# EAGLE design untitled (EAGLE 7.2.0)
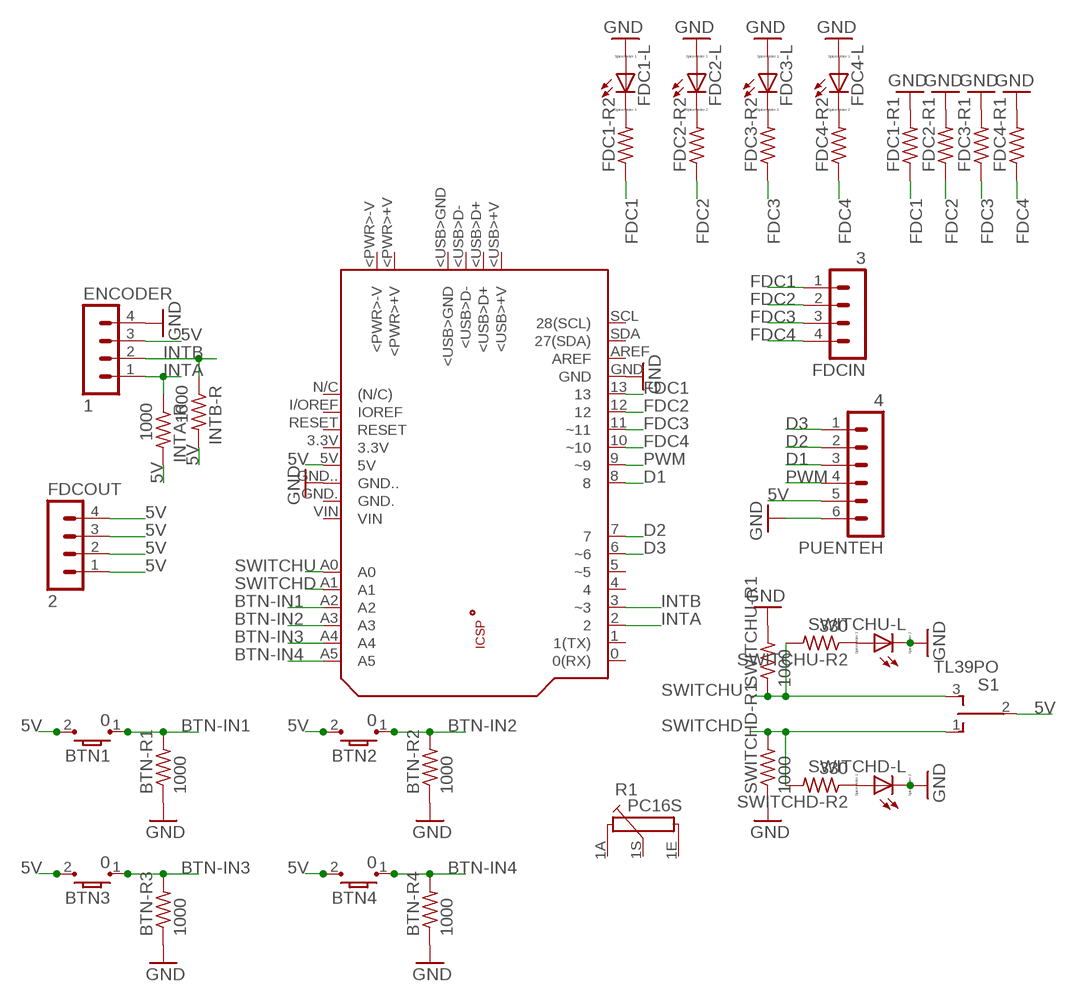
[diagram p0: schematic, sheet 1]

## Parts
BTN1  0  TL3302-J  [TL3303_J]
BTN2  0  TL3302-J  [TL3303_J]
BTN3  0  TL3302-J  [TL3303_J]
BTN4  0  TL3302-J  [TL3303_J]
BTN-R1  1000  R-US_0204/7  [0204/7]
BTN-R2  1000  R-US_0204/7  [0204/7]
BTN-R3  1000  R-US_0204/7  [0204/7]
BTN-R4  1000  R-US_0204/7  [0204/7]
ENCODER  1  MA04-1  [MA04-1]
FDC1-L  LED_ELD260  [LED_LD260]
FDC1-R1  R-US_0204/7  [0204/7]
FDC1-R2  R-US_0204/7  [0204/7]
FDC2-L  LED_ELD260  [LED_LD260]
FDC2-R1  R-US_0204/7  [0204/7]
FDC2-R2  R-US_0204/7  [0204/7]
FDC3-L  LED_ELD260  [LED_LD260]
FDC3-R1  R-US_0204/7  [0204/7]
FDC3-R2  R-US_0204/7  [0204/7]
FDC4-L  LED_ELD260  [LED_LD260]
FDC4-R1  R-US_0204/7  [0204/7]
FDC4-R2  R-US_0204/7  [0204/7]
FDCIN  3  MA04-1  [MA04-1]
FDCOUT  2  MA04-1  [MA04-1]
INTA-R  1000  R-US_0204/7  [0204/7]
INTB-R  1000  R-US_0204/7  [0204/7]
PCB1  ARDUINO_UNO  [ARDUINO_UNO]
PUENTEH  4  MA06-1  [MA06-1]
R1  PC16S  [PC16S]
S1  TL39PO  [TL3XPO]
SWITCHD-L  LED_ELD260  [LED_LD260]
SWITCHD-R1  1000  R-US_0204/7  [0204/7]
SWITCHD-R2  330  R-US_0204/7  [0204/7]
SWITCHU-L  LED_ELD260  [LED_LD260]
SWITCHU-R1  1000  R-US_0204/7  [0204/7]
SWITCHU-R2  330  R-US_0204/7  [0204/7]

## Nets
5V: BTN1.2 BTN2.2 BTN3.2 BTN4.2 ENCODER.3 FDCOUT.1 FDCOUT.2 FDCOUT.3 FDCOUT.4 INTA-R.2 INTB-R.2 PCB1.5V PUENTEH.5 S1.2(P)
BTN-IN1: BTN1.1 BTN-R1.2 PCB1.A2
BTN-IN2: BTN2.1 BTN-R2.2 PCB1.A3
BTN-IN3: BTN3.1 BTN-R3.2 PCB1.A4
BTN-IN4: BTN4.1 BTN-R4.2 PCB1.A5
D1: PCB1.8 PUENTEH.3
D2: PCB1.7 PUENTEH.2
D3: PCB1.6(~6) PUENTEH.1
FDC1: FDC1-R1.1 FDC1-R2.1 FDCIN.1 PCB1.13
FDC2: FDC2-R1.1 FDC2-R2.1 FDCIN.2 PCB1.12
FDC3: FDC3-R1.1 FDC3-R2.1 FDCIN.3 PCB1.11(~11)
FDC4: FDC4-R1.1 FDC4-R2.1 FDCIN.4 PCB1.10(~10)
GND: BTN-R1.1 BTN-R2.1 BTN-R3.1 BTN-R4.1 ENCODER.4 FDC1-L.A FDC1-R1.2 FDC2-L.A FDC2-R1.2 FDC3-L.A FDC3-R1.2 FDC4-L.A FDC4-R1.2 PCB1.GND PCB1.GND.. PUENTEH.6 SWITCHD-L.K(C) SWITCHD-R1.1 SWITCHU-L.K(C) SWITCHU-R1.2
INTA: ENCODER.1 INTA-R.1 PCB1.2
INTB: ENCODER.2 INTB-R.1 PCB1.3(~3)
N$1: FDC1-L.K(C) FDC1-R2.2
N$2: FDC2-L.K(C) FDC2-R2.2
N$3: SWITCHU-L.A SWITCHU-R2.1
N$4: SWITCHD-L.A SWITCHD-R2.1
N$6: FDC3-L.K(C) FDC3-R2.2
N$7: FDC4-L.K(C) FDC4-R2.2
PWM: PCB1.9(~9) PUENTEH.4
SWITCHD: PCB1.A1 S1.1(O) SWITCHD-R1.2 SWITCHD-R2.2
SWITCHU: PCB1.A0 S1.3(S) SWITCHU-R1.1 SWITCHU-R2.2
Unconnected: PCB1.0(0(RX)) PCB1.1(1(TX)) PCB1.3.3V PCB1.4 PCB1.5(~5) PCB1.+5V PCB1.<PWR>+V PCB1.<PWR>-V PCB1.<USB>+V PCB1.<USB>D+ PCB1.<USB>D- PCB1.<USB>GND PCB1.AREF PCB1.GND. PCB1.GND_ PCB1.I/OREF(IOREF) PCB1.MISO PCB1.MOSI PCB1.N/C((N/C)) PCB1.RESET PCB1.RESET. PCB1.SCK PCB1.SCL(28(SCL)) PCB1.SDA(27(SDA)) PCB1.VIN R1.1A R1.1E R1.1S

## Library data of the parts
BTN1-BTN4 = eswitch-tact:TL3302: E-Switch TL3302 Series Tactile Switch Surface mount button commonly used for reset or general input. 3.5 x 6mm packaged design. -G: Gull wing termination. Parts TL-3302-x-xxxx-x-G -J: J-Lead termination. Parts TL-3302-x-xxxx-x-J Source: http://www.e-switch.com/Portals/0/Series_Pdf/TL3302.pdf Supplier: DigiKey: http://be.digikey.com/scripts/dksearch/dksus.dll?vendor=0&keywords=TL3302
BTN-R1-BTN-R4 FDC1-R1 FDC1-R2 FDC2-R1 FDC2-R2 FDC3-R1 FDC3-R2 FDC4-R1 FDC4-R2 INTA-R INTB-R SWITCHD-R1 SWITCHD-R2 SWITCHU-R1 SWITCHU-R2 = resistor:R-US_: RESISTOR, American symbol
ENCODER FDCIN FDCOUT = con-lstb:MA04-1: PIN HEADER; OC_FARNELL: unknown; OC_NEWARK: unknown
FDC1-L FDC2-L FDC3-L FDC4-L SWITCHD-L SWITCHU-L = eagle-ltspice:LED_E: LED Source: http://www.osram.convergy.de Source: www.luxeon.com Source: www.kingbright.com; SPICEMODEL: NONE; SPICEPREFIX: D; SPICETYPE: diode
PCB1 = E14_Arduino_revB:ARDUINO_UNO: Device for representing an Arduino Uno board with a footprint in an EAGLE design. Created by Dave Young for Element14. More EAGLE documentation at: http://www.element14.com/community/community/knode/cadsoft_eagle
PUENTEH = con-lstb:MA06-1: PIN HEADER; OC_FARNELL: unknown; OC_NEWARK: unknown
R1 = piher:PC16S: POTENTIOMETER single carbon potentiometer, 16 mm, S3ROH; OC_FARNELL: 4452940; OC_NEWARK: unknown
S1 = switch:TL39PO: TINY SWITCH ON OFF ON Source: http://www2.produktinfo.conrad.com/datenblaetter/700000-724999/705152-da-01-de-Subminiaturschalter_TL_36YO.pdf

## Board
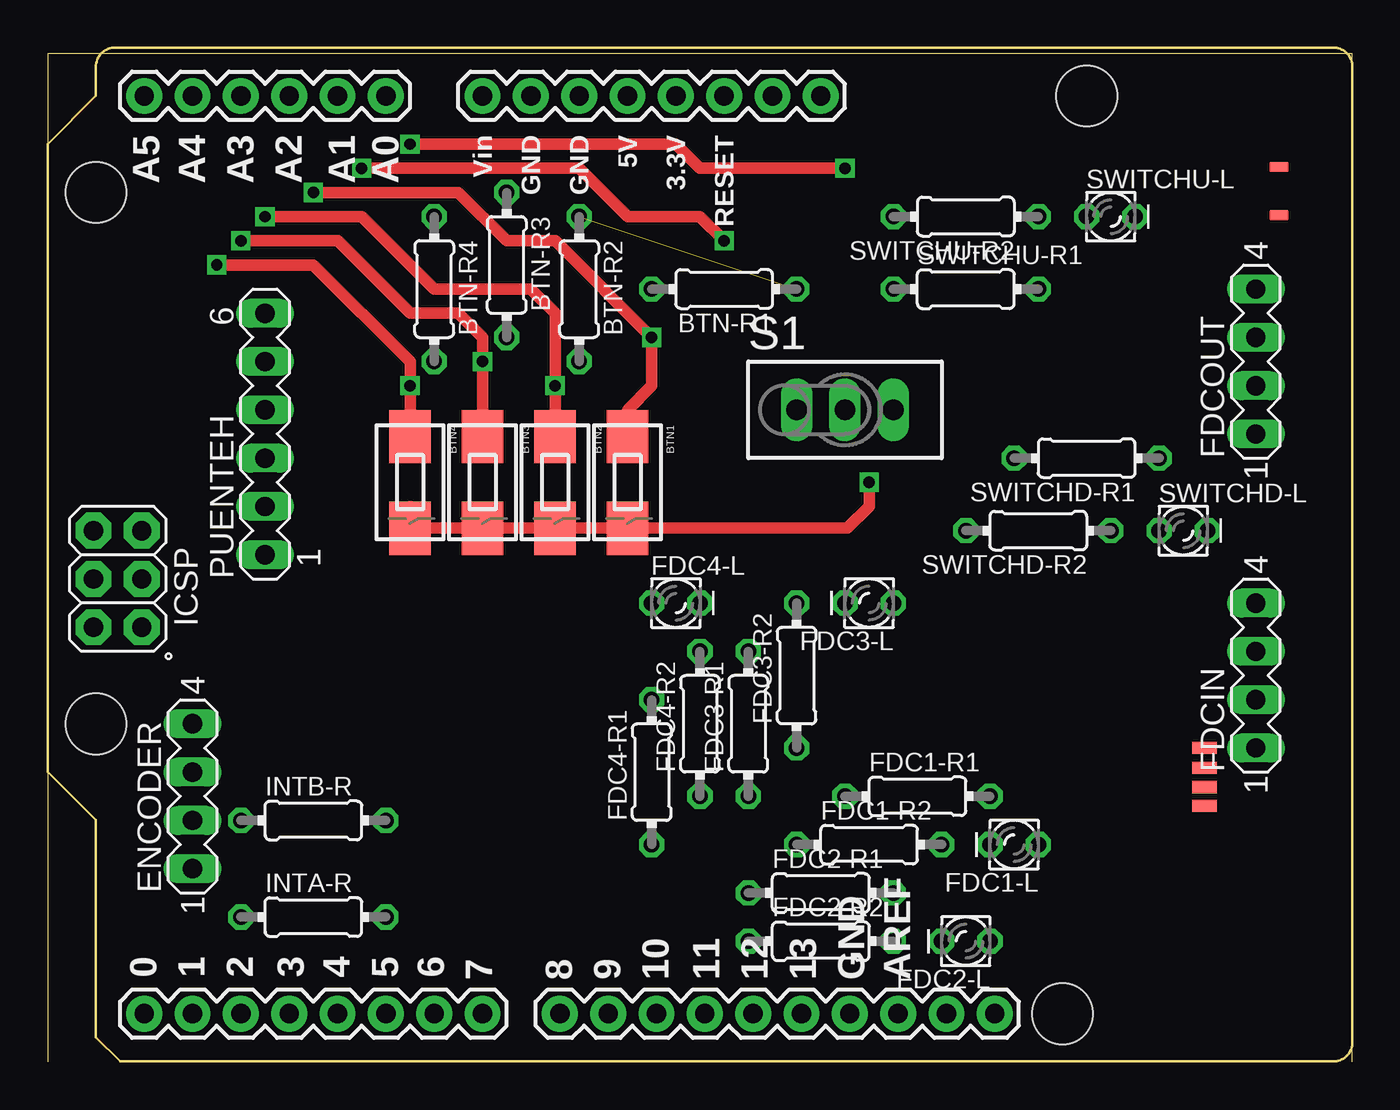
[diagram p1: board, top side]
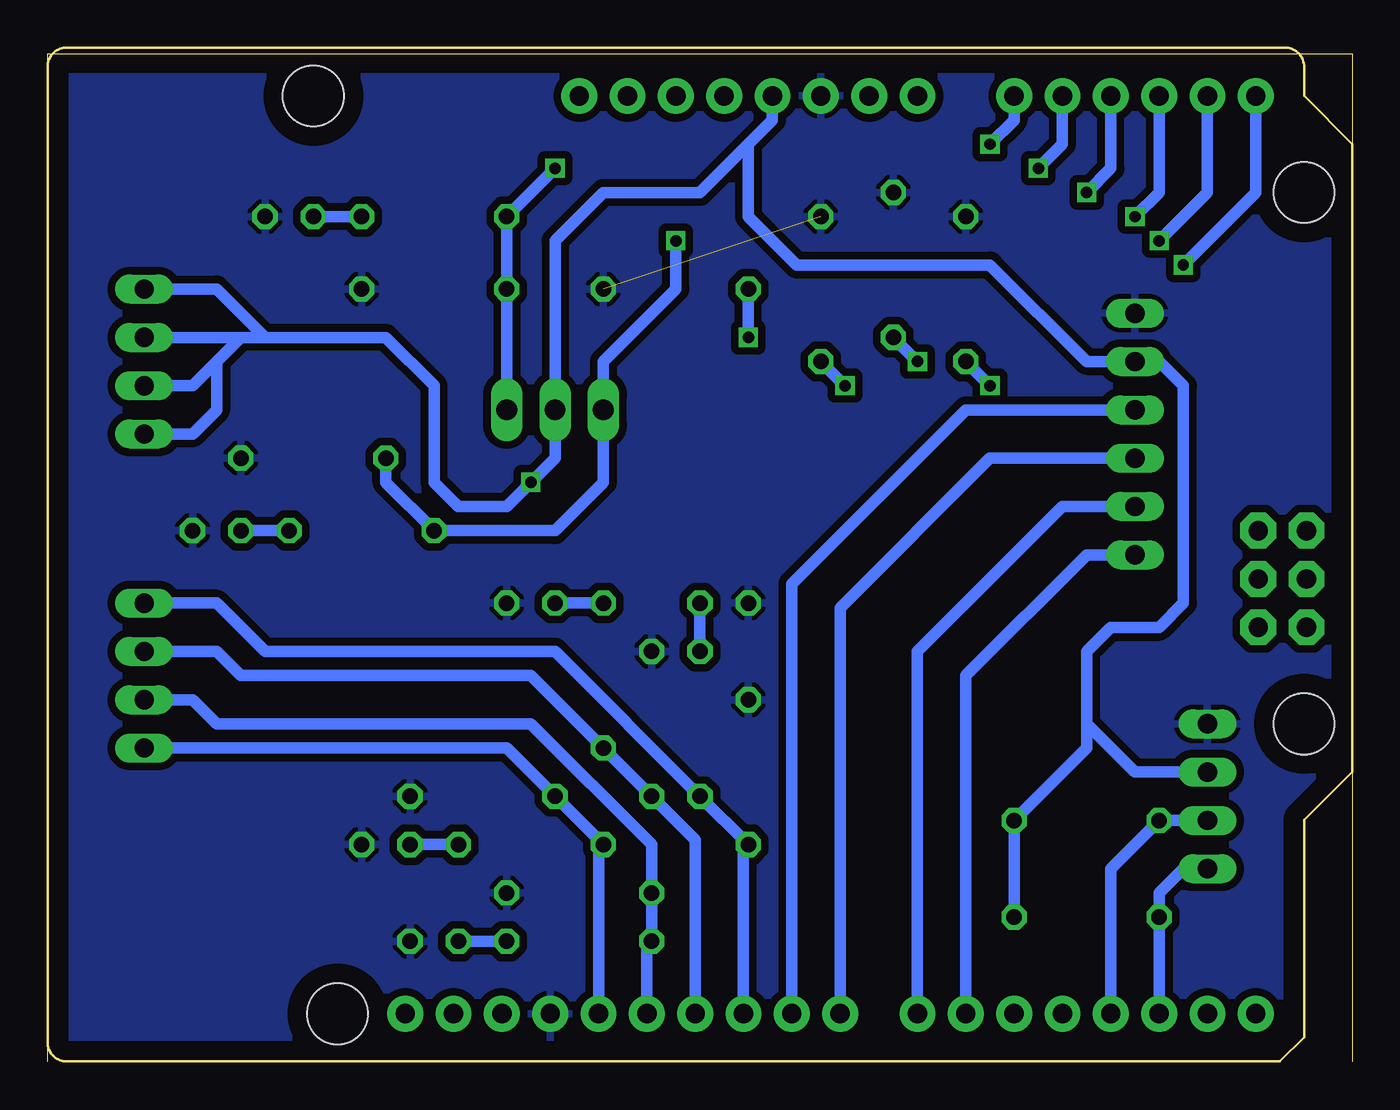
[diagram p2: board, bottom side, seen from below]

Size 68.58 x 53.34 mm. Coordinates in mm from the lower left corner, seen from the top.
Outline: 68.56,0 68.56,53.01 0,53.01 0,0
Copper layers (1*16): Top 0.035mm / dielectric 1.5mm / Bottom 0.035mm
Design rules "default": minimum track width 10mil, minimum drill 24mil, track to track 8mil, track to pad 8mil, pad to pad 8mil, via to via 8mil, smd to smd 8mil, copper to edge 40mil, drill to drill 8mil, minimum pad ring 10mil, minimum via ring 8mil, stop-mask expansion 4mil, vias tented up to drill 0mil, thermal gap 10mil

### Footprints (pad centres in the part's own frame; a part is rotated, then mirrored left to right if it is on the bottom)
TL3303_J = smd 2.794 x 2.159: 1 -2.413,0; 2 2.413,0
0204/7 = drill 0.813 octagon: 1 -3.81,0; 2 3.81,0
MA04-1 = drill 1.016 long: 1 -3.81,0; 2 -1.27,0; 3 1.27,0; 4 3.81,0
LED_LD260 = drill 0.813 octagon: A -1.27,0; K 1.27,0
ARDUINO_UNO = drill 1.016 pad 1.88: 0 63.5,50.8; 1 60.96,50.8; 2 58.42,50.8; 3 55.88,50.8; 3.3V 35.56,2.54; 4 53.34,50.8; 5 50.8,50.8; 5V 38.1,2.54; 6 48.26,50.8; 7 45.72,50.8; 8 41.656,50.8; 9 39.116,50.8; 10 36.576,50.8; 11 34.036,50.8; 12 31.496,50.8; 13 28.956,50.8; A0 50.8,2.54; A1 53.34,2.54; A2 55.88,2.54; A3 58.42,2.54; A4 60.96,2.54; A5 63.5,2.54; AREF 23.876,50.8; GND 26.416,50.8; GND. 43.18,2.54; GND.. 40.64,2.54; I/OREF 30.48,2.54; N/C 27.94,2.54; RESET 33.02,2.54; SCL 18.796,50.8; SDA 21.336,50.8; VIN 45.72,2.54 | drill 1.016 pad 1.88 octagon: +5V 66.167,30.48; GND_ 66.167,25.4; MISO 63.627,30.48; MOSI 66.167,27.94; RESET. 63.627,25.4; SCK 63.627,27.94 | smd 1.016 x 0.508: <PWR>+V 3.861,8.814; <PWR>-V 3.861,6.274 | smd 1.27 x 0.635: <USB>+V 7.772,39.878; <USB>D+ 7.772,38.887; <USB>D- 7.772,37.871; <USB>GND 7.772,36.83 | hole 3.2: 66.04,7.62; 66.04,35.56; 15.24,50.8; 13.97,2.54
MA06-1 = drill 1.016 long: 1 -6.35,0; 2 -3.81,0; 3 -1.27,0; 4 1.27,0; 5 3.81,0; 6 6.35,0
PC16S = drill 1.2 long: 1A -5,6.5; 1E 5,6.5; 1S 0,6.5
TL3XPO = drill 1.1 pad 1.422 long: 1 -2.54,0; 2 0,0; 3 2.54,0

### Placement (x,y rotation side)
BTN1  30.48,30.48 270 top
BTN2  26.67,30.48 270 top
BTN3  22.86,30.48 270 top
BTN4  19.05,30.48 270 top
BTN-R1  35.56,40.64 180 top
BTN-R2  27.94,40.64 270 top
BTN-R3  24.13,41.91 270 top
BTN-R4  20.32,40.64 270 top
ENCODER  7.62,13.97 90 top
FDC1-L  50.8,11.43 180 top
FDC1-R1  45.72,13.97 0 top
FDC1-R2  43.18,11.43 0 top
FDC2-L  48.26,6.35 180 top
FDC2-R1  40.64,8.89 0 top
FDC2-R2  40.64,6.35 0 top
FDC3-L  43.18,24.13 180 top
FDC3-R1  36.83,17.78 90 top
FDC3-R2  39.37,20.32 90 top
FDC4-L  33.02,24.13 0 top
FDC4-R1  31.75,15.24 90 top
FDC4-R2  34.29,17.78 90 top
FDCIN  63.5,20.32 90 top
FDCOUT  63.5,36.83 90 top
INTA-R  13.97,7.62 0 top
INTB-R  13.97,12.7 0 top
PCB1  68.58,53.34 180 top
PUENTEH  11.43,33.02 90 top
R1  -11.43,45.72 0 top  (outside the outline)
S1  41.91,34.29 0 top
SWITCHD-L  59.69,27.94 0 top
SWITCHD-R1  54.61,31.75 180 top
SWITCHD-R2  52.07,27.94 180 top
SWITCHU-L  55.88,44.45 0 top
SWITCHU-R1  48.26,40.64 0 top
SWITCHU-R2  48.26,44.45 180 top

### Tracks (layer width: path | path; a pad name or v marks a point on that pad's centre or on a via)
5V  (via drill 0.6)
  Top 0.61: v43.18,30.48 43.18,29.21 42.04,28.07 BTN1.2 BTN2.2 BTN3.2 BTN4.2 19.05,29.21
  Bottom 0.61: ENCODER.3 11.43,15.24 13.97,17.78 | 13.97,17.78 13.97,21.59 12.7,22.86 10.16,22.86 8.89,24.13 8.89,35.56 10.16,36.83 PUENTEH.5 13.97,36.83 19.05,41.91 29.21,41.91 31.75,44.45 31.75,48.26 | 13.97,17.78 13.97,16.51 INTB-R.2 INTA-R.2 | PCB1.5V 30.48,49.53 31.75,48.26 | 57.15,38.1 50.8,38.1 48.26,35.56 48.26,30.48 46.99,29.21 44.45,29.21 v43.18,30.48 41.91,31.75 S1.2 41.91,43.18 39.37,45.72 34.29,45.72 31.75,48.26 | 57.15,38.1 58.42,38.1 | 58.42,38.1 59.69,36.83 | 59.69,36.83 59.69,34.29 60.96,33.02 FDCOUT.1 | FDCOUT.2 60.96,35.56 59.69,36.83 | FDCOUT.3 58.42,38.1 | FDCOUT.4 59.69,40.64 57.15,38.1
BTN-IN1  (via drill 0.6)
  Top 0.61: BTN1.1 30.48,34.29 31.75,35.56 v31.75,38.1 26.67,43.18 24.13,43.18 21.59,45.72 v13.97,45.72
  Bottom 0.61: v31.75,38.1 BTN-R1.2 | v13.97,45.72 12.7,46.99 PCB1.A2
BTN-IN2  (via drill 0.6)
  Top 0.61: v11.43,44.45 16.51,44.45 20.32,40.64 25.4,40.64 26.67,39.37 v26.67,35.56 BTN2.1
  Bottom 0.61: PCB1.A3 10.16,45.72 v11.43,44.45 | BTN-R2.2 v26.67,35.56
BTN-IN3  (via drill 0.6)
  Top 0.61: BTN3.1 v22.86,36.83 22.86,38.1 21.59,39.37 19.05,39.37 15.24,43.18 v10.16,43.18
  Bottom 0.61: PCB1.A4 7.62,45.72 v10.16,43.18 | BTN-R3.2 v22.86,36.83
BTN-IN4  (via drill 0.6)
  Top 0.61: BTN4.1 v19.05,35.56 19.05,36.83 13.97,41.91 v8.89,41.91
  Bottom 0.61: v19.05,35.56 BTN-R4.2 | PCB1.A5 5.08,45.72 v8.89,41.91
D1
  Bottom 0.61: PUENTEH.3 19.05,31.75 26.92,23.88 PCB1.8
D2
  Bottom 0.61: PUENTEH.2 15.24,29.21 22.86,21.59 PCB1.7
D3
  Bottom 0.61: PUENTEH.1 13.97,26.67 20.32,20.32 PCB1.6
FDC1
  Bottom 0.61: FDCIN.1 44.45,16.51 FDC1-R1.1 FDC1-R2.1 39.62,11.18 PCB1.13
FDC2
  Bottom 0.406: 37.08,6.1 FDC2-R2.1
  Bottom 0.61: FDCIN.2 60.96,19.05 59.69,17.78 43.18,17.78 36.83,11.43 FDC2-R1.1 FDC2-R2.1 | PCB1.12 37.08,6.1
FDC3
  Bottom 0.61: FDCIN.3 59.69,21.59 58.42,20.32 43.18,20.32 FDC3-R2.1 FDC3-R1.1 34.54,11.68 PCB1.11
FDC4
  Bottom 0.61: PCB1.10 32,11.18 FDC4-R1.1 FDC4-R2.1 41.91,21.59 57.15,21.59 59.69,24.13 FDCIN.4
GND  (1 unrouted)
  pour Bottom (isolate 0.406, rank 6): 0,54.61 68.58,54.61 68.58,0 0,0
INTA
  Bottom 0.61: ENCODER.1 8.89,10.16 10.16,8.89 INTA-R.1 PCB1.2
INTB
  Bottom 0.61: ENCODER.2 INTB-R.1 12.7,10.16 PCB1.3
N$1
  Bottom 0.61: FDC1-R2.2 FDC1-L.K
N$2
  Bottom 0.61: FDC2-R2.2 FDC2-L.K
N$3
  Bottom 0.61: SWITCHU-R2.1 SWITCHU-L.A
N$4
  Bottom 0.61: SWITCHD-R2.1 SWITCHD-L.A
N$6
  Bottom 0.61: FDC3-R2.2 FDC3-L.K
N$7
  Bottom 0.61: FDC4-L.K FDC4-R2.2
PWM
  Bottom 0.61: PUENTEH.4 20.32,34.29 29.46,25.15 PCB1.9
SWITCHD  (via drill 0.6)
  Top 0.61: v16.51,46.99 27.94,46.99 30.48,44.45 34.29,44.45 v35.56,43.18
  Bottom 0.61: SWITCHD-R1.2 50.8,30.48 SWITCHD-R2.2 41.91,27.94 39.37,30.48 S1.1 39.37,36.83 35.56,40.64 v35.56,43.18 | PCB1.A1 15.24,48.26 v16.51,46.99
SWITCHU  (via drill 0.6)
  Top 0.61: v19.05,48.26 33.02,48.26 34.29,46.99 v41.91,46.99
  Bottom 0.61: S1.3 SWITCHU-R1.1 SWITCHU-R2.2 v41.91,46.99 | PCB1.A0 17.78,49.53 v19.05,48.26